# EAGLE schematic STM32-TX (EAGLE 6.5.0)
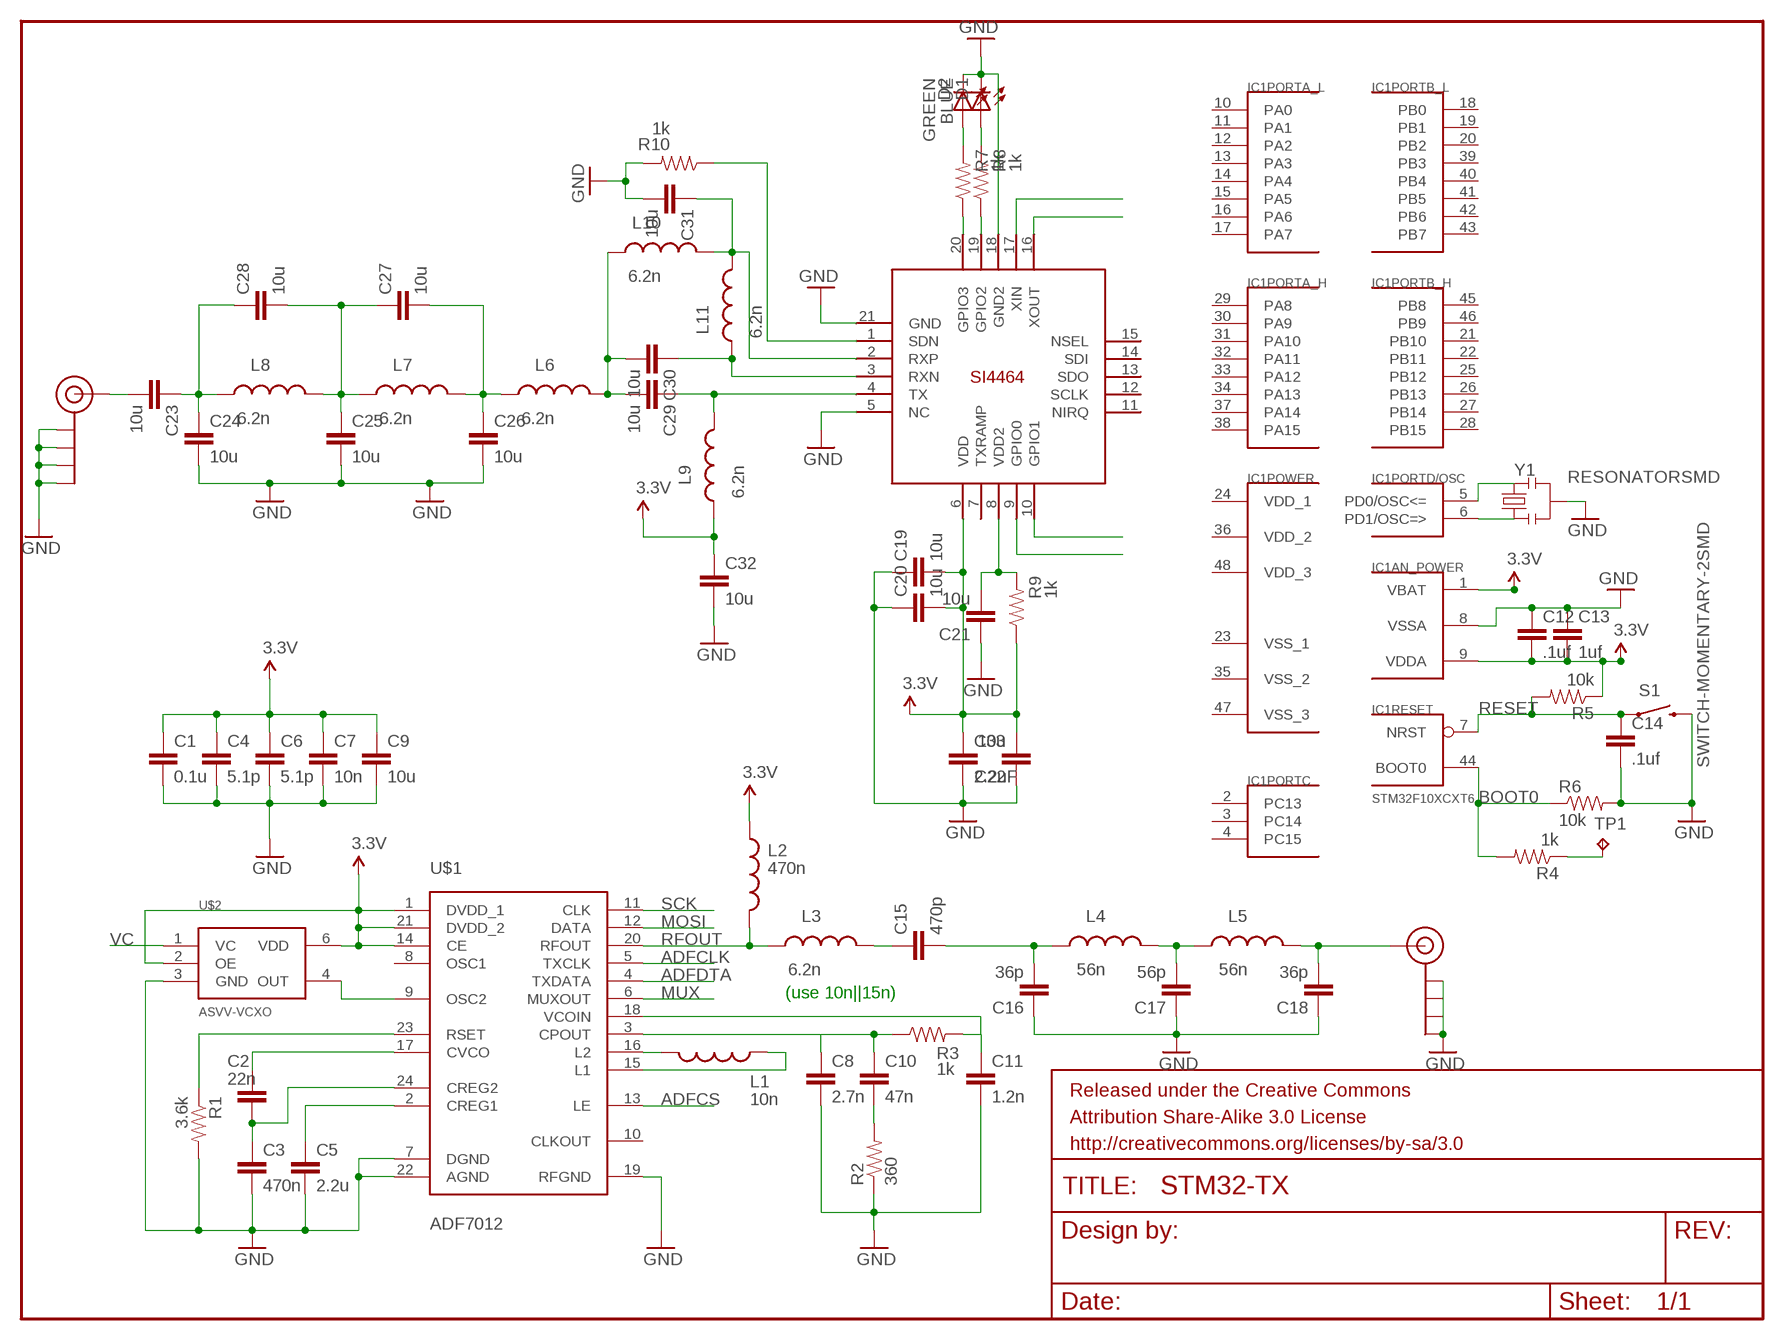
[diagram p0: schematic, sheet 1]

## Parts
C1  0.1u  CAP0603-CAP  [0603-CAP]
C2  22n  CAP0603-CAP  [0603-CAP]
C3  470n  CAP0603-CAP  [0603-CAP]
C4  5.1p  CAP0603-CAP  [0603-CAP]
C5  2.2u  CAP0603-CAP  [0603-CAP]
C6  5.1p  CAP0603-CAP  [0603-CAP]
C7  10n  CAP0603-CAP  [0603-CAP]
C8  2.7n  CAP0603-CAP  [0603-CAP]
C9  10u  CAP0603-CAP  [0603-CAP]
C10  47n  CAP0603-CAP  [0603-CAP]
C11  1.2n  CAP0603-CAP  [0603-CAP]
C12  .1uf  CAP0402-CAP  [0402-CAP]
C13  1uf  CAP0402-CAP  [0402-CAP]
C14  .1uf  CAP0402-CAP  [0402-CAP]
C15  470p  CAP0603-CAP  [0603-CAP]
C16  36p  CAP0603-CAP  [0603-CAP]
C17  56p  CAP0603-CAP  [0603-CAP]
C18  36p  CAP0603-CAP  [0603-CAP]
C19  10u  CAP0603-CAP  [0603-CAP]
C20  10u  CAP0603-CAP  [0603-CAP]
C21  10u  CAP0603-CAP  [0603-CAP]
C22  10u  CAP0603-CAP  [0603-CAP]
C23  10u  CAP0603-CAP  [0603-CAP]
C24  10u  CAP0603-CAP  [0603-CAP]
C25  10u  CAP0603-CAP  [0603-CAP]
C26  10u  CAP0603-CAP  [0603-CAP]
C27  10u  CAP0603-CAP  [0603-CAP]
C28  10u  CAP0603-CAP  [0603-CAP]
C29  10u  CAP0603-CAP  [0603-CAP]
C30  10u  CAP0603-CAP  [0603-CAP]
C31  10u  CAP0603-CAP  [0603-CAP]
C32  10u  CAP0603-CAP  [0603-CAP]
C33  2.2uF  2.2UF-CERCAP-10009  [1206]
D1  BLUE  LED-BLUE0603  [LED-0603]
D2  GREEN  LED-GREEN0603  [LED-0603]
FRAME1  FRAME-LETTER  [CREATIVE_COMMONS]
IC1  STM32F10XCXT6  [TQFP48]
J$1  SMA_EDGE  [SMA-EDGE]
J$2  SMA_EDGE  [SMA-EDGE]
L1  10n  INDUCTOR0603  [0603]
L2  470n  INDUCTOR0603  [0603]
L3  6.2n  INDUCTOR0603  [0603]
L4  56n  INDUCTOR0402  [C0402]
L5  56n  INDUCTOR0402  [C0402]
L6  6.2n  INDUCTOR0603  [0603]
L7  6.2n  INDUCTOR0603  [0603]
L8  6.2n  INDUCTOR0603  [0603]
L9  6.2n  INDUCTOR0603  [0603]
L10  6.2n  INDUCTOR0603  [0603]
L11  6.2n  INDUCTOR0603  [0603]
R1  3.6k  RESISTOR0603-RES  [0603-RES]
R2  360  RESISTOR0603-RES  [0603-RES]
R3  1k  RESISTOR0603-RES  [0603-RES]
R4  1k  RESISTOR0402-RES  [0402-RES]
R5  10k  RESISTOR0402-RES  [0402-RES]
R6  10k  RESISTOR0402-RES  [0402-RES]
R7  1k  RESISTOR0603-RES  [0603-RES]
R8  1k  RESISTOR0603-RES  [0603-RES]
R9  1k  RESISTOR0603-RES  [0603-RES]
R10  1k  RESISTOR0603-RES  [0603-RES]
S1  SWITCH-MOMENTARY-2SMD  [TACTILE_SWITCH_SMD]
TP1  TPTP09R  [TP09R]
U$1  ADF7012  [TSSOP-24]
U$2  ASVV-VCXO  [6-SMD]
U$3  SI4464  [QFN20+GNDPAD]
Y1  RESONATORSMD  [RESONATOR-SMD]

## Nets
3.3V: C1.1 C4.1 C6.1 C7.1 C9.1 C12.2 C13.2 C19.2 C20.2 C22.2 C32.1 C33.1 IC1.1(AN_POWER:VBAT) IC1.9(AN_POWER:VDDA) L2.1 L9.1 R5.1 R9.1 U$1.1(DVDD_1) U$1.14(CE) U$1.21(DVDD_2) U$2.2(OE) U$2.6(VDD) U$3.6(VDD)
ADFCLK: U$1.5(TXCLK)
ADFCS: U$1.13(LE)
ADFDTA: U$1.4(TXDATA)
BOOT0: IC1.44(RESET:BOOT0) R4.2 R6.1
GND: C1.2 C3.2 C4.2 C5.2 C6.2 C7.2 C8.2 C9.2 C11.2 C12.1 C13.1 C14.2 C16.1 C17.1 C18.1 C19.1 C20.1 C21.1 C22.1 C24.2 C25.2 C26.2 C31.2 C32.2 C33.2 D1.C D2.C IC1.8(AN_POWER:VSSA) J$1.GND@0(GND) J$1.GND@1(GND) J$1.GND@2(GND) J$1.GND@3(GND) J$2.GND@0(GND) J$2.GND@1(GND) J$2.GND@2(GND) J$2.GND@3(GND) R1.2 R2.1 R6.2 R10.2 S1.3 U$1.7(DGND) U$1.19(RFGND) U$1.22(AGND) U$2.3(GND) U$3.5(NC ) U$3.18(GND2) U$3.21(GND) Y1.2
MOSI: U$1.12(DATA)
MUX: U$1.6(MUXOUT)
N$1: C5.1 U$1.2(CREG1)
N$2: IC1.6(PORTD/OSC:PD1/OSC=>) Y1.1
N$3: IC1.5(PORTD/OSC:PD0/OSC<=) Y1.3
N$4: C2.1 U$1.17(CVCO)
N$5: R1.1 U$1.23(RSET)
N$6: C2.2 C3.1 U$1.24(CREG2)
N$7: L1.2 U$1.16(L2)
N$8: R4.1 TP1.TP
N$9: L1.1 U$1.15(L1)
N$10: C8.1 C10.1 R3.1 U$1.3(CPOUT)
N$11: C11.1 R3.2 U$1.18(VCOIN)
N$12: C10.2 R2.2
N$13: U$1.9(OSC2) U$2.4(OUT)
N$14: C15.1 L3.2
N$15: C15.2 C16.2 L4.1
N$16: C17.2 L4.2 L5.1
N$17: C18.2 J$1.SIG(SIGNAL) L5.2
N$18: C23.2 J$2.SIG(SIGNAL)
N$19: C23.1 C24.1 C28.1 L8.1
N$20: U$3.10(GPIO1)
N$21: C25.1 C27.1 C28.2 L7.1 L8.2
N$22: C26.1 C27.2 L6.1 L7.2
N$23: C29.1 L9.2 U$3.4(TX)
N$24: C29.2 C30.2 L6.2 L10.1
N$25: C30.1 L11.1 U$3.3(RXN)
N$26: C31.1 L10.2 L11.2 U$3.2(RXP)
N$27: R10.1 U$3.1(SDN)
N$31: D1.A R8.2
N$32: D2.A R7.2
N$33: R7.1 U$3.20(GPIO3)
N$34: R8.1 U$3.19(GPIO2)
N$35: U$3.16(XOUT)
N$36: U$3.17(XIN)
N$38: U$3.9(GPIO0)
N$39: C21.2 R9.2 U$3.8(VDD2)
RESET: C14.1 IC1.7(RESET:NRST) R5.2 S1.1
RFOUT: L2.2 L3.1 U$1.20(RFOUT)
SCK: U$1.11(CLK)
VC: U$2.1(VC)
Unconnected: IC1.2(PORTC:PC13) IC1.3(PORTC:PC14) IC1.4(PORTC:PC15) IC1.10(PORTA_L:PA0) IC1.11(PORTA_L:PA1) IC1.12(PORTA_L:PA2) IC1.13(PORTA_L:PA3) IC1.14(PORTA_L:PA4) IC1.15(PORTA_L:PA5) IC1.16(PORTA_L:PA6) IC1.17(PORTA_L:PA7) IC1.18(PORTB_L:PB0) IC1.19(PORTB_L:PB1) IC1.20(PORTB_L:PB2) IC1.21(PORTB_H:PB10) IC1.22(PORTB_H:PB11) IC1.25(PORTB_H:PB12) IC1.26(PORTB_H:PB13) IC1.27(PORTB_H:PB14) IC1.28(PORTB_H:PB15) IC1.29(PORTA_H:PA8) IC1.30(PORTA_H:PA9) IC1.31(PORTA_H:PA10) IC1.32(PORTA_H:PA11) IC1.33(PORTA_H:PA12) IC1.34(PORTA_H:PA13) IC1.37(PORTA_H:PA14) IC1.38(PORTA_H:PA15) IC1.39(PORTB_L:PB3) IC1.40(PORTB_L:PB4) IC1.41(PORTB_L:PB5) IC1.42(PORTB_L:PB6) IC1.43(PORTB_L:PB7) IC1.45(PORTB_H:PB8) IC1.46(PORTB_H:PB9) U$1.8(OSC1) U$1.10(CLKOUT) U$3.7(TXRAMP) U$3.11(NIRQ) U$3.12(SCLK) U$3.13(SDO) U$3.14(SDI) U$3.15(NSEL)

## Notes on the sheet
- (use 10n||15n)

## Power pins joined to a net without a drawn wire
VDD_1: IC1.24(POWER:VDD_1)
VDD_2: IC1.36(POWER:VDD_2)
VDD_3: IC1.48(POWER:VDD_3)
VSS_1: IC1.23(POWER:VSS_1)
VSS_2: IC1.35(POWER:VSS_2)
VSS_3: IC1.47(POWER:VSS_3)

## Library data of the parts
C1-C11 C15-C32 = SparkFun-Capacitors:CAP: Capacitor Standard 0603 ceramic capacitor, and 0.1" leaded capacitor.
C12-C14 = SparkFun:CAP: Capacitor Standard 0603 ceramic capacitor, and 0.1" leaded capacitor.
C33 = SparkFun-Capacitors:2.2UF-CER: 2.2uF Ceramic SMT CAP-07888- 10V, 20% (0603) CAP-10009- 50V, 10% (1206); PROD_ID: CAP-10009
D1 = SparkFun-LED:LED-BLUE: Blue LEDs for production use Various blue LEDs stocked by SparkFun production 0603 - DIO-08575 Rebel - DIO-09553 1206 - DIO-09911; PROD_ID: DIO-08575
D2 = SparkFun-LED:LED-GREEN: Various green LEDs 0603- DIO-00821 LARGE- DIO-00862 LILYPAD- DIO-09910; PROD_ID: DIO-00821
FRAME1 = SparkFun-Aesthetics:FRAME-LETTER: Schematic Frame Standard 8.5x11 US Letter frame
IC1 = stm32:STM32F10XCXT6: ST STM32F101/103 48pin LQFP
J$1 J$2 = SparkFun-Connectors:SMA_EDGE: SMA Antenna Connector End launch SMA connector. The paste layer has been removed so that the connector can be hand soldered onto the board after reflow.
L1-L11 = SparkFun-Passives:INDUCTOR: Inductors Basic Inductor/Choke - 0603 and 1206. Footprints are not proven and vary greatly between part numbers. SRN6045- 33uH, 20% 1.4A
R1-R3 R7-R10 = SparkFun-Passives:RESISTOR: Resistor Basic schematic elements and footprints for 0603, 1206, and PTH resistors.
R4-R6 = SparkFun:RESISTOR: Resistor Basic schematic elements and footprints for 0603, 1206, and PTH resistors.
S1 = SparkFun:SWITCH-MOMENTARY-2
TP1 = testpad:TP: Test pad
U$1 = AD RF:ADF7012
U$2 = AD RF:ASVV-VCXO
U$3 = Ava:SI4464
Y1 = SparkFun:RESONATOR: Resonator Small SMD resonator. This is the itty bitty 10/20MHz resonators with built in caps. CSTCE10M0G55 and CSTCE20M0V53. Footprint has been reviewed closely but hasn't been tested yet.